# Altium schematic sheet 01-MAIN.SchDoc
size A
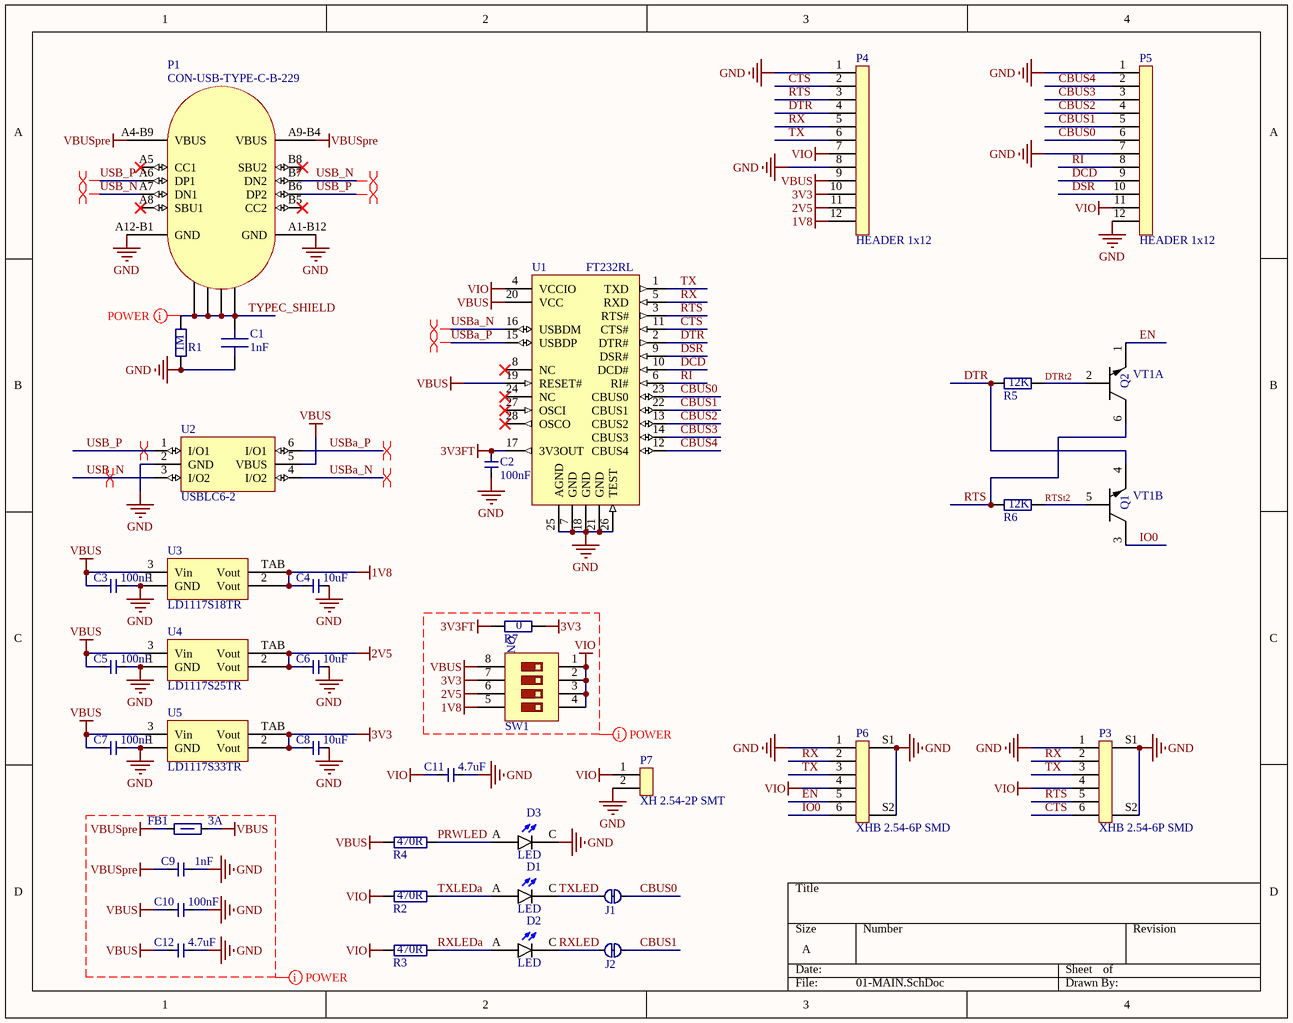
[diagram p0: 01-MAIN.SchDoc]

## Parts
C1  1nF  [C1206]
C2  100nF  [C0603_NOSILK]
C3  100nF  [C0603_NOSILK]
C4  10uF  [C0805]
C5  100nF  [C0603_NOSILK]
C6  10uF  [C0805]
C7  100nF  [C0603_NOSILK]
C8  10uF  [C0805]
C9  1nF  [C0603_NOSILK]
C10  100nF  [C0603_NOSILK]
C11  4.7uF  [C0805]
C12  4.7uF  [C0805]
D1  LED  [LED_0805]
D2  LED  [LED_0805]
D3  LED  [LED_0805]
FB1  Imax: 3A  [FER1206]  (hidden comment: FB_BLM31PG500SN1L)
J1  CFG2_CUT  [CFG_J_d1_CUT]  (value not drawn)
J2  CFG2_CUT  [CFG_J_d1_CUT]  (value not drawn)
P1  CON-USB-TYPE-C-B-229  [USB-Type-C-B-229]
P3  XHB 2.54-6P SMD  [XHB-2.54-6P]
P4  HEADER 1x12  [HEADER 1x12 2.54 NO PINS]
P5  HEADER 1x12  [HEADER 1x12 2.54 NO PINS]
P6  XHB 2.54-6P SMD  [XHB-2.54-6P]
P7  XH 2.54-2P SMT  [XH2.54-2P]
R1  Resistance: 1M  [R2512]
R2  Resistance: 470R  [R0603_NOSILK]
R3  Resistance: 470R  [R0603_NOSILK]
R4  Resistance: 470R  [R0603_NOSILK]
R5  Resistance: 12K  [R0603_NOSILK]
R6  Resistance: 12K  [R0603_NOSILK]
R7  Resistance: 0  [R0603_NOSILK]
SW1  KLS7-KL-04-N-0-0  [KLS7-KL-04-N-0-0]  (value not drawn)
U1  FT232RL  [SSOP28_0.65_7.8]
U2  USBLC6-2  [SOT-23-6L]
U3  LD1117S18TR  [SOT-223]
U4  LD1117S25TR  [SOT-223]
U5  LD1117S33TR  [SOT-223]
VT1  BC847BDW1T1G  [SOT363/SOT65P210X110-6N]  (value not drawn)  (parts A,B of 2)

## Nets
1V8: C4.1 P4.12 SW1.5 U3.2(Vout) U3.TAB(Vout)
2V5: C6.1 P4.11 SW1.6 U4.2(Vout) U4.TAB(Vout)
3V3: C8.1 P4.10 R7.2 SW1.7 U5.2(Vout) U5.TAB(Vout)
3V3FT: C2.2 R7.1 U1.17(3V3OUT)
GND: C1.1 C2.1 C3.1 C4.2 C5.1 C6.2 C7.1 C8.2 C9.2 C10.1 C11.1 C12.1 D3.C P1.A1-B12(GND) P1.A12-B1(GND) P3.1 P3.S1 P3.S2 P4.1 P4.8 P5.1 P5.7 P5.12 P6.1 P6.S1 P6.S2 P7.2 R1.1 U1.7(GND) U1.18(GND) U1.21(GND) U1.25(AGND) U1.26(TEST) U2.2(GND) U3.1(GND) U4.1(GND) U5.1(GND)
VBUS: C3.2 C5.2 C7.2 C10.2 C12.2 FB1.2 P4.9 R4.1 SW1.8 U1.19(RESET#) U1.20(VCC) U2.5(VBUS) U3.3(Vin) U4.3(Vin) U5.3(Vin)
VBUSpre: C9.1 FB1.1 P1.A4-B9(VBUS) P1.A9-B4(VBUS)
VIO: C11.2 P3.4 P4.7 P5.11 P6.4 P7.1 R2.1 R3.1 SW1.1 SW1.2 SW1.3 SW1.4 U1.4(VCCIO)
CBUS0: J1.2(IN) P5.6 U1.23(CBUS0)
CBUS1: J2.2(IN) P5.5 U1.22(CBUS1)
CBUS2: P5.4 U1.13(CBUS2)
CBUS3: P5.3 U1.14(CBUS3)
CBUS4: P5.2 U1.12(CBUS4)
CTS: P3.6 P4.2 U1.11(CTS#)
DCD: P5.9 U1.10(DCD#)
DSR: P5.10 U1.9(DSR#)
DTR: P4.4 R5.1 U1.2(DTR#) VT1.4
DTRt2: R5.2 VT1.2
EN: P6.5 VT1.1
IO0: P6.6 VT1.3
PRWLED: D3.A R4.2
RI: P5.8 U1.6(RI#)
RTS: P3.5 P4.3 R6.1 U1.3(RTS#) VT1.6
RTSt2: R6.2 VT1.5
RX: P3.2 P4.5 P6.2 U1.5(RXD)
RXLED: D2.C J2.1(A)
RXLEDa: D2.A R3.2
TX: P3.3 P4.6 P6.3 U1.1(TXD)
TXLED: D1.C J1.1(A)
TXLEDa: D1.A R2.2
TYPEC_SHIELD: C1.2 P1.SHIELD R1.2
USB_N: P1.A7(DN1) P1.B7(DN2) U2.3(I/O2)
USB_P: P1.A6(DP1) P1.B6(DP2) U2.1(I/O1)
USBa_N: U1.16(USBDM) U2.4(I/O2)
USBa_P: U1.15(USBDP) U2.6(I/O1)

Not connected (* = marked no-connect by the designer): P1 A5(CC1)* A8(SBU1)* B5(CC2)* B8(SBU2)*; U1 8(NC)* 24(NC)* 27(OSCI_)* 28(OSCO_)*

## Layout directives
differential pair; net class USB; differential pair class USB1: USB_N, USB_P, USBa_N, USBa_P
net class POWER_NET_CLASS: 1V8, 2V5, 3V3, 3V3FT, GND, TYPEC_SHIELD, VBUS, VBUSpre, VIO

## Notes on the sheet
- (in symbol BC847BDW1T1G, part A) Q2
- (in symbol BC847BDW1T1G, part B) Q1
- (in symbol KLS7-KL-04-N-0-0) ON

## Library data of the parts
C1 = C1206_1nF_2KV: Ceramic capacitor; Voltage: 2KV; Capacity: 1nF; Size: 1206; Value: 1nF; PriceRCSUAH: 1,7; RCS: https://www.rcscomponents.kiev.ua/product/1nf-2000v-x7r-10-1206-3k-reel-1206b102k202n3-hitano-kondensatory-keramicheskie-smd_11455.html
C2 C3 C5 C7 C10 = C0603_100nF_16V: Ceramic capacitor; Voltage: 16V; MF: YAGEO; MP: CC0603KRX7R7BB104; Capacity: 100nF; Size: 0603; PriceKosmodromUAH: 1; Kosmodrom: http://www.kosmodrom.com.ua/el.php?name=CP06030.125V8020; LCSC: C108079; PriceLCSC: 0.0049; ComponentLink1Description: URLLCSC; ComponentLink1URL: https://lcsc.com/product-detail/Multilayer-Ceramic-Capacitors-MLCC-SMD-SMT_YAGEO-CC0603KRX7R7BB104_C108079.html; Value: 100nF
C4 C6 C8 = C0805_10uF_10V: Ceramic capacitor; Voltage: 10V; Capacity: 10uF; Size: 0805; Value: 10uF
C9 = C0603_1nF_25V: Ceramic capacitor; Voltage: 25V; Capacity: 1nF; Size: 0603; PriceKosmodromUAH: 0,75; Kosmodrom: http://www.kosmodrom.com.ua/el.php?name=CP0603100050V10; Value: 1nF
C11 C12 = C0805_4.7uF_10V: Ceramic capacitor; Voltage: 10V; Capacity: 4.7uF; Size: 0805; LCSC: https://lcsc.com/product-detail/Multilayer-Ceramic-Capacitors-MLCC-SMD-SMT_Samsung-Electro-Mechanics-CL21B475KPFNNNE_C87998.html; Value: 4.7uF
D1-D3 = LED: Led General; MF: Dialight; MP: 598-8140-107F; Owned: 3000; SnapEDA_Link: https://www.snapeda.com/parts/598-8140-107F/Dialight/view-part/?ref=snap; Price: None; Availability: Unavailable; Package: 0805 Dialight; Value: *
FB1 = FB_BLM31PG500SN1L: RDC: 25 mOhm; Impedance: 50 Ohm; PriceKosmodrom: 8; ComponentLink1Description: URLKosmodrom; ComponentLink1URL: http://www.kosmodrom.com.ua/el.php?name=BLM31PG500SN1L
P1 = CON-USB-TYPE-C-B-229: Type C 3A Throughthole Shell, USB2 + PD SMD pins; PriceKosmodromUAH: 8,25; Kosmodrom: http://www.kosmodrom.com.ua/el.php?name=USB-Type-C-B-229
P3 P6 = XHB 2.54-6P SMD: JST XHB 2.54 pin header SMD Horizontal; ComponentLink1Description: URLLCSC
P7 = XH 2.54-2P SMT: JST XH 2.54 pin header SMT Vertical; ComponentLink1Description: URLLCSC
R1 = R2512_1M_5%: Resistor General; Tolerance: 5%; Size: 2512; PriceRCSUAH: 0,75; RCS: https://www.rcscomponents.kiev.ua/product/1-mohm-5-1w-2512-rc2512jk-1mr-hitano-rezistor-smd_51251.html
R2-R4 = R0603_470R: Resistor General; Tolerance: 5%; Owned: 3000; Size: 0603
R5 R6 = R0603_12K: Resistor General; Tolerance: 5%; Owned: 3000; Size: 0603; PriceRCSUAH: 0,06; RCS: https://www.rcscomponents.kiev.ua/product/12-kohm-5-0-1w-50v-0603-rc0603jr-12k0-hitano-rezistor-smd_1014.html
R7 = R0603_0R: Resistor General; Tolerance: *; Size: 0603; PriceRCSUAH: 0,06; RCS: https://www.rcscomponents.kiev.ua/product/0-ohm-5-0-1w-50v-0603-rc0603jr-0r-hitano-rezistor-smd_4159.html
U2 = USBLC6-2: Very low capacitance ESD protection; PriceKosmodromUAH: 4,25; Kosmodrom: http://www.kosmodrom.com.ua/el.php?name=USBLC6-2P6
U3 = LD1117S18TR: Low drop fixed and adjustable positive voltage regulators
U4 = LD1117S25TR: Low drop fixed and adjustable positive voltage regulators
U5 = LD1117S33TR: Low drop fixed and adjustable positive voltage regulators
VT1 = BC847BDW1T1G: Dual General Purpose Transistors NPN SOT 363; PriceKosmodromUAH: 1,5; Kosmodrom: http://www.kosmodrom.com.ua/el.php?name=BC847BDW1T1G
SW1 = KLS7-KL-04-N-0-0: ComponentLink1Description: URLRCS; ComponentLink1URL: https://www.rcscomponents.kiev.ua/product/pereklyuchatel-swd4-4-kls7-kl-04-n-0-0_89374.html